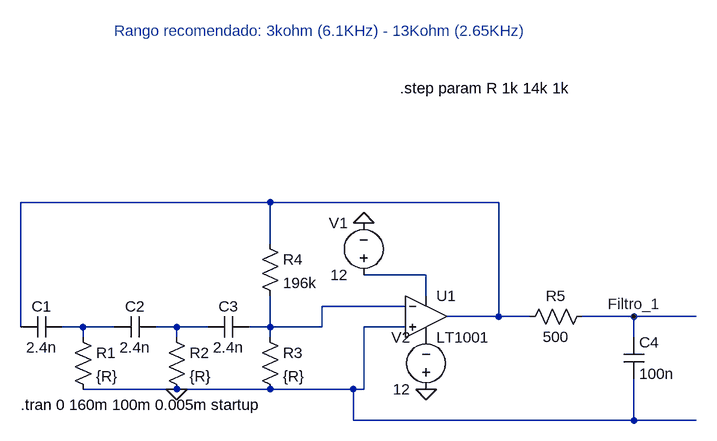
[diagram p0: schematic Oscilador-RC-AmpOp.asc]
Oscilador-RC-AmpOp.asc, the LTspice schematic file:
Version 4.1
SHEET 1 1516 680
WIRE 336 -48 -48 -48
WIRE 688 -48 336 -48
WIRE 336 16 336 -48
WIRE 576 64 480 64
WIRE 576 96 576 64
WIRE 544 112 416 112
WIRE 688 128 688 -48
WIRE 688 128 608 128
WIRE 736 128 688 128
WIRE 896 128 816 128
WIRE 992 128 896 128
WIRE -48 144 -48 -48
WIRE 48 144 16 144
WIRE 96 144 48 144
WIRE 192 144 160 144
WIRE 240 144 192 144
WIRE 336 144 336 96
WIRE 336 144 304 144
WIRE 416 144 416 112
WIRE 416 144 336 144
WIRE 544 144 480 144
WIRE 48 160 48 144
WIRE 192 160 192 144
WIRE 336 160 336 144
WIRE 896 160 896 128
WIRE 192 240 48 240
WIRE 336 240 192 240
WIRE 464 240 336 240
WIRE 480 240 480 144
WIRE 480 240 464 240
WIRE 464 288 464 240
WIRE 896 288 896 224
WIRE 896 288 464 288
WIRE 992 288 896 288
FLAG 192 240 0
FLAG 480 -16 0
FLAG 576 240 0
FLAG 896 128 Filtro_1
SYMBOL cap 16 128 R90
WINDOW 0 0 32 VBottom 2
WINDOW 3 32 32 VTop 2
SYMATTR InstName C1
SYMATTR Value 2.4n
SYMBOL cap 160 128 R90
WINDOW 0 0 32 VBottom 2
WINDOW 3 32 32 VTop 2
SYMATTR InstName C2
SYMATTR Value 2.4n
SYMBOL cap 304 128 R90
WINDOW 0 0 32 VBottom 2
WINDOW 3 32 32 VTop 2
SYMATTR InstName C3
SYMATTR Value 2.4n
SYMBOL res 32 144 R0
SYMATTR InstName R1
SYMATTR Value {R}
SYMBOL res 176 144 R0
SYMATTR InstName R2
SYMATTR Value {R}
SYMBOL res 320 144 R0
SYMATTR InstName R3
SYMATTR Value {R}
SYMBOL res 320 0 R0
SYMATTR InstName R4
SYMATTR Value 196k
SYMBOL voltage 480 80 R180
WINDOW 0 24 96 Left 2
WINDOW 3 24 16 Left 2
WINDOW 123 0 0 Left 0
WINDOW 39 0 0 Left 0
SYMATTR InstName V1
SYMATTR Value 12
SYMBOL voltage 576 256 R180
WINDOW 0 24 96 Left 2
WINDOW 3 24 16 Left 2
WINDOW 123 0 0 Left 0
WINDOW 39 0 0 Left 0
SYMATTR InstName V2
SYMATTR Value 12
SYMBOL OpAmps\\LT1001 576 64 R0
SYMATTR InstName U1
SYMBOL res 832 112 R90
WINDOW 0 0 56 VBottom 2
WINDOW 3 32 56 VTop 2
SYMATTR InstName R5
SYMATTR Value 500
SYMBOL cap 880 160 R0
SYMATTR InstName C4
SYMATTR Value 100n
TEXT -48 264 Left 2 !.tran 0 160m 100m 0.005m startup
TEXT 96 -312 Left 2 ;Rango recomendado: 3kohm (6.1KHz) - 13Kohm (2.65KHz)
TEXT 536 -224 Left 2 !.step param R 1k 14k 1k

The netlist it stands for:
* Oscilador-RC-AmpOp.asc
C1 N004 N001 2.4n
C2 N005 N004 2.4n
C3 N003 N005 2.4n
R1 N004 0 {R}
R2 N005 0 {R}
R3 N003 0 {R}
R4 N001 N003 196k
V1 N002 0 12
V2 0 P001 12
X§U1 0 N003 N002 P001 N001 LT1001  ; pins In+ In- V+ V- OUT
R5 Filtro_1 N001 500
C4 Filtro_1 0 100n
.tran 0 160m 100m 0.005m startup
* Rango recomendado: 3kohm (6.1KHz) - 13Kohm (2.65KHz)
.step param R 1k 14k 1k
.lib LTC.lib
.backanno
.end